# Altium schematic sheet PowerAndServo.SchDoc
size A
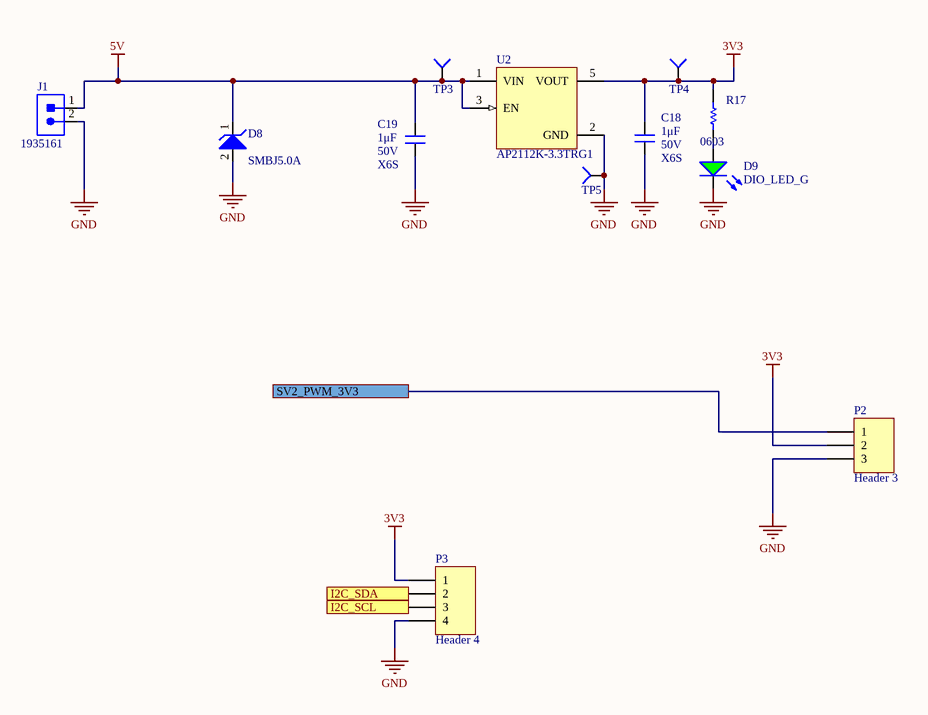
[diagram p0: PowerAndServo.SchDoc]

## Parts
C18  value 1μF  Dielectric: X6S  Voltage Rating: 50V  [CAP0603]  (hidden comment: CAP_1uF_50V_0603)
C19  value 1μF  Dielectric: X6S  Voltage Rating: 50V  [CAP0603]  (hidden comment: CAP_1uF_50V_0603)
D8  TVS_DIODE_UNIDIR_5V  [SMBJ5.0A]  (value not drawn)
D9  DIO_LED_G  [LED_0805_GREEN]
J1  CON_2M_TERM  [1935161]  (value not drawn)
P2  Header 3  [HDR1X3]
P3  Header 4  [HDR1X4]
R17  Package/Footprint: 0603  [RESC0603]  (hidden comment: RES_120Ω_0603_5%_HP)
TP3  TESTPOINT_SMD_LOOP  [S1751-46R]  (value not drawn)
TP4  TESTPOINT_SMD_LOOP  [S1751-46R]  (value not drawn)
TP5  TESTPOINT_SMD_LOOP  [S1751-46R]  (value not drawn)
U2  Manufacturer Part Number 1: AP2112K-3.3TRG1  [SOT95P285X140-5N]  (hidden comment: LDO_3.3V_600mA)

## Ports
I2C_SCL, I2C_SDA, SV2_PWM_3V3

## Nets
3V3: C18.2 P2.2 P3.1 R17.2 TP4.1(=value) U2.5(VOUT)
5V: C19.2 D8.1 J1.1 TP3.1(=value) U2.1(VIN) U2.3(EN)
GND: C18.1 C19.1 D8.2 D9.2(K) J1.2 P2.3 P3.4 TP5.1(=value) U2.2(GND)
I2C_SCL: P3.3 ; port I2C_SCL
I2C_SDA: P3.2 ; port I2C_SDA
SV2_PWM_3V3: P2.1 ; port SV2_PWM_3V3
NetD9_1: D9.1(A) R17.1

## Library data of the parts
C18 C19 = CAP_1uF_50V_0603: CAP CER 1UF 50V X6S 0603; Manufacturer 1: TDK Corporation; Manufacturer Part Number 1: C1608X6S1H105K080AC; Supplier Part Number 1: 445-7424-1-ND; Supplier 1: Digi-Key
D8 = TVS_DIODE_UNIDIR_5V: TVS DIODE 5V 9.2V SMB; Manufacturer 1: Bourns; Supplier 1: Digi-Key; Supplier Part Number 1: SMBJ5.0ABCT-ND; Manufacturer Part Number 1: SMBJ5.0A; Mounting Type: SMD; Package/Footprint: SMB
D9 = DIO_LED_G: LED GREEN DIFFUSED 0805 SMD; Manufacturer Part Number 1: LG R971-KN-1; Manufacturer 1: OSRAM; Forward Voltage Drop: 2.2V; Package/Footprint: 0805; Supplier Part Number 1: 475-1410-1-ND; Supplier 1: Digi-Key; Mounting Type: SMD
J1 = CON_2M_TERM: TERM BLK 2POS SIDE ENTRY 5MM; Manufacturer 1: Phoenix Contact; Max Current Rating: 16A; Current: 18A; Voltage: 300V; Package/Footprint: SMD; Supplier 1: Digi-Key; Manufacturer Part Number 1: 1935161; Supplier Part Number 1: 277-1667-ND; Mounting Type: TH
P2 = Header 3: Header, 3-Pin; LatestRevisionDate: 17-Jul-2002; LatestRevisionNote: Re-released for DXP Platform.; Publisher: Altium Limited
P3 = Header 4: Header, 4-Pin; LatestRevisionDate: 17-Jul-2002; LatestRevisionNote: Re-released for DXP Platform.; Publisher: Altium Limited
R17 = RES_120Ω_0603_5%_HP: RES 120 OHM 5% 1/4W 0603; Manufacturer 1: Rohm; Manufacturer Part Number 1: ESR03EZPJ121; Supplier Part Number 1: RHM120DCT-ND; Supplier 1: Digi-Key; Mounting Type: SMD
TP3-TP5 = TESTPOINT_SMD_LOOP: TESTPOINT SMD; Manufacturer 1: Harwin; Supplier 1: Digi-Key; Manufacturer Part Number 1: S1751-46R; Supplier Part Number 1: 952-1478-1-ND; Mounting Type: SMD; Package/Footprint: SMD
U2 = LDO_3.3V_600mA: IC REG LINEAR 3.3V 600MA SOT25; Manufacturer 1: Diodes Incorporated; Input Voltage (Max): 6V; Voltage Dropout (Max): 0.4V; Package/Footprint: SOT-25; Supplier 1: Digi-Key; Supplier Part Number 1: AP2112K-3.3TRG1DICT-ND; Output Voltage (Fixed): 3.3V; Output Current: 600mA; Operating Temperature: -40°C - 85°C; LCSC Part #: C51118; Mounting Type: SMD